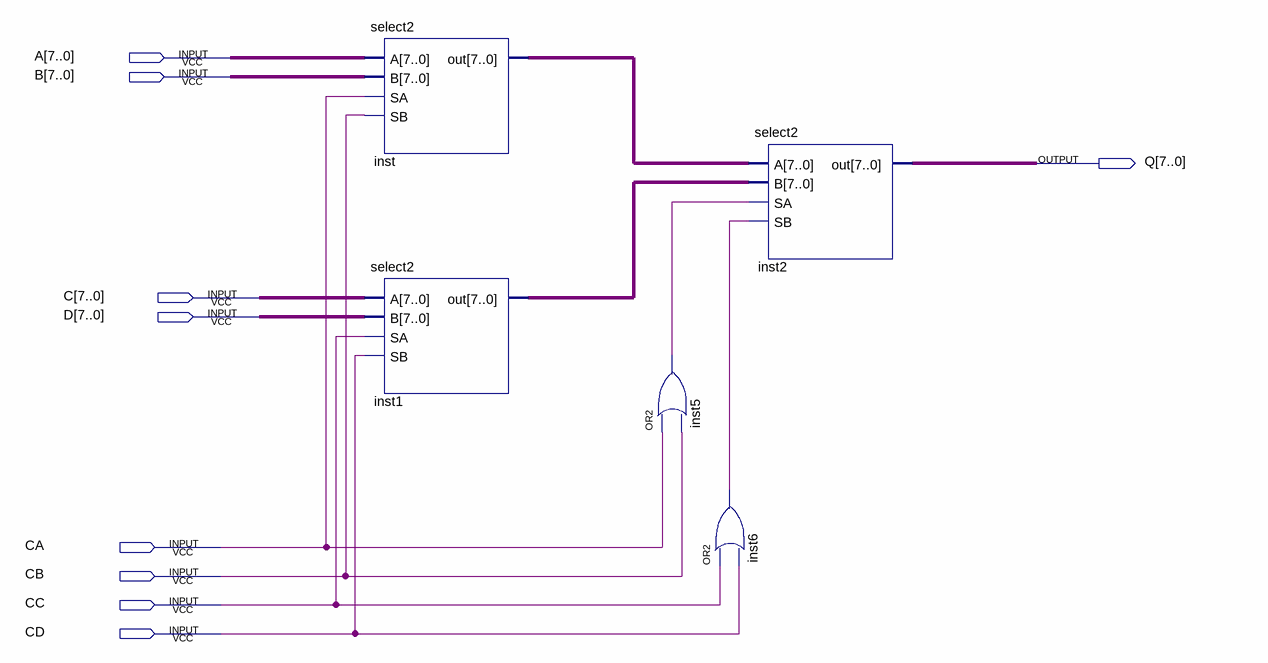
[diagram p0: schematic sheet]
// Quartus schematic select4.bdf as structural Verilog: 5 symbols, 9 pins
module select4 (
  input  [7:0] A,
  input  [7:0] B,
  input  [7:0] C,
  input  [7:0] D,
  input  CA,
  input  CB,
  input  CC,
  input  CD,
  output [7:0] Q
);

  wire inst5_out, inst6_out;
  wire [7:0] inst1_out, inst_out;

  select2 inst (.A(A), .B(B), .SA(CA), .SB(CB), .out(inst_out));
  select2 inst1 (.A(C), .B(D), .SA(CC), .SB(CD), .out(inst1_out));
  or inst5 (inst5_out, CA, CB);
  select2 inst2 (.A(inst_out), .B(inst1_out), .SA(inst5_out), .SB(inst6_out), .out(Q));
  or inst6 (inst6_out, CC, CD);
endmodule
